# EAGLE design Pulsar Buddy rev A (EAGLE 9.5.2)

## Sheet 1 of 2
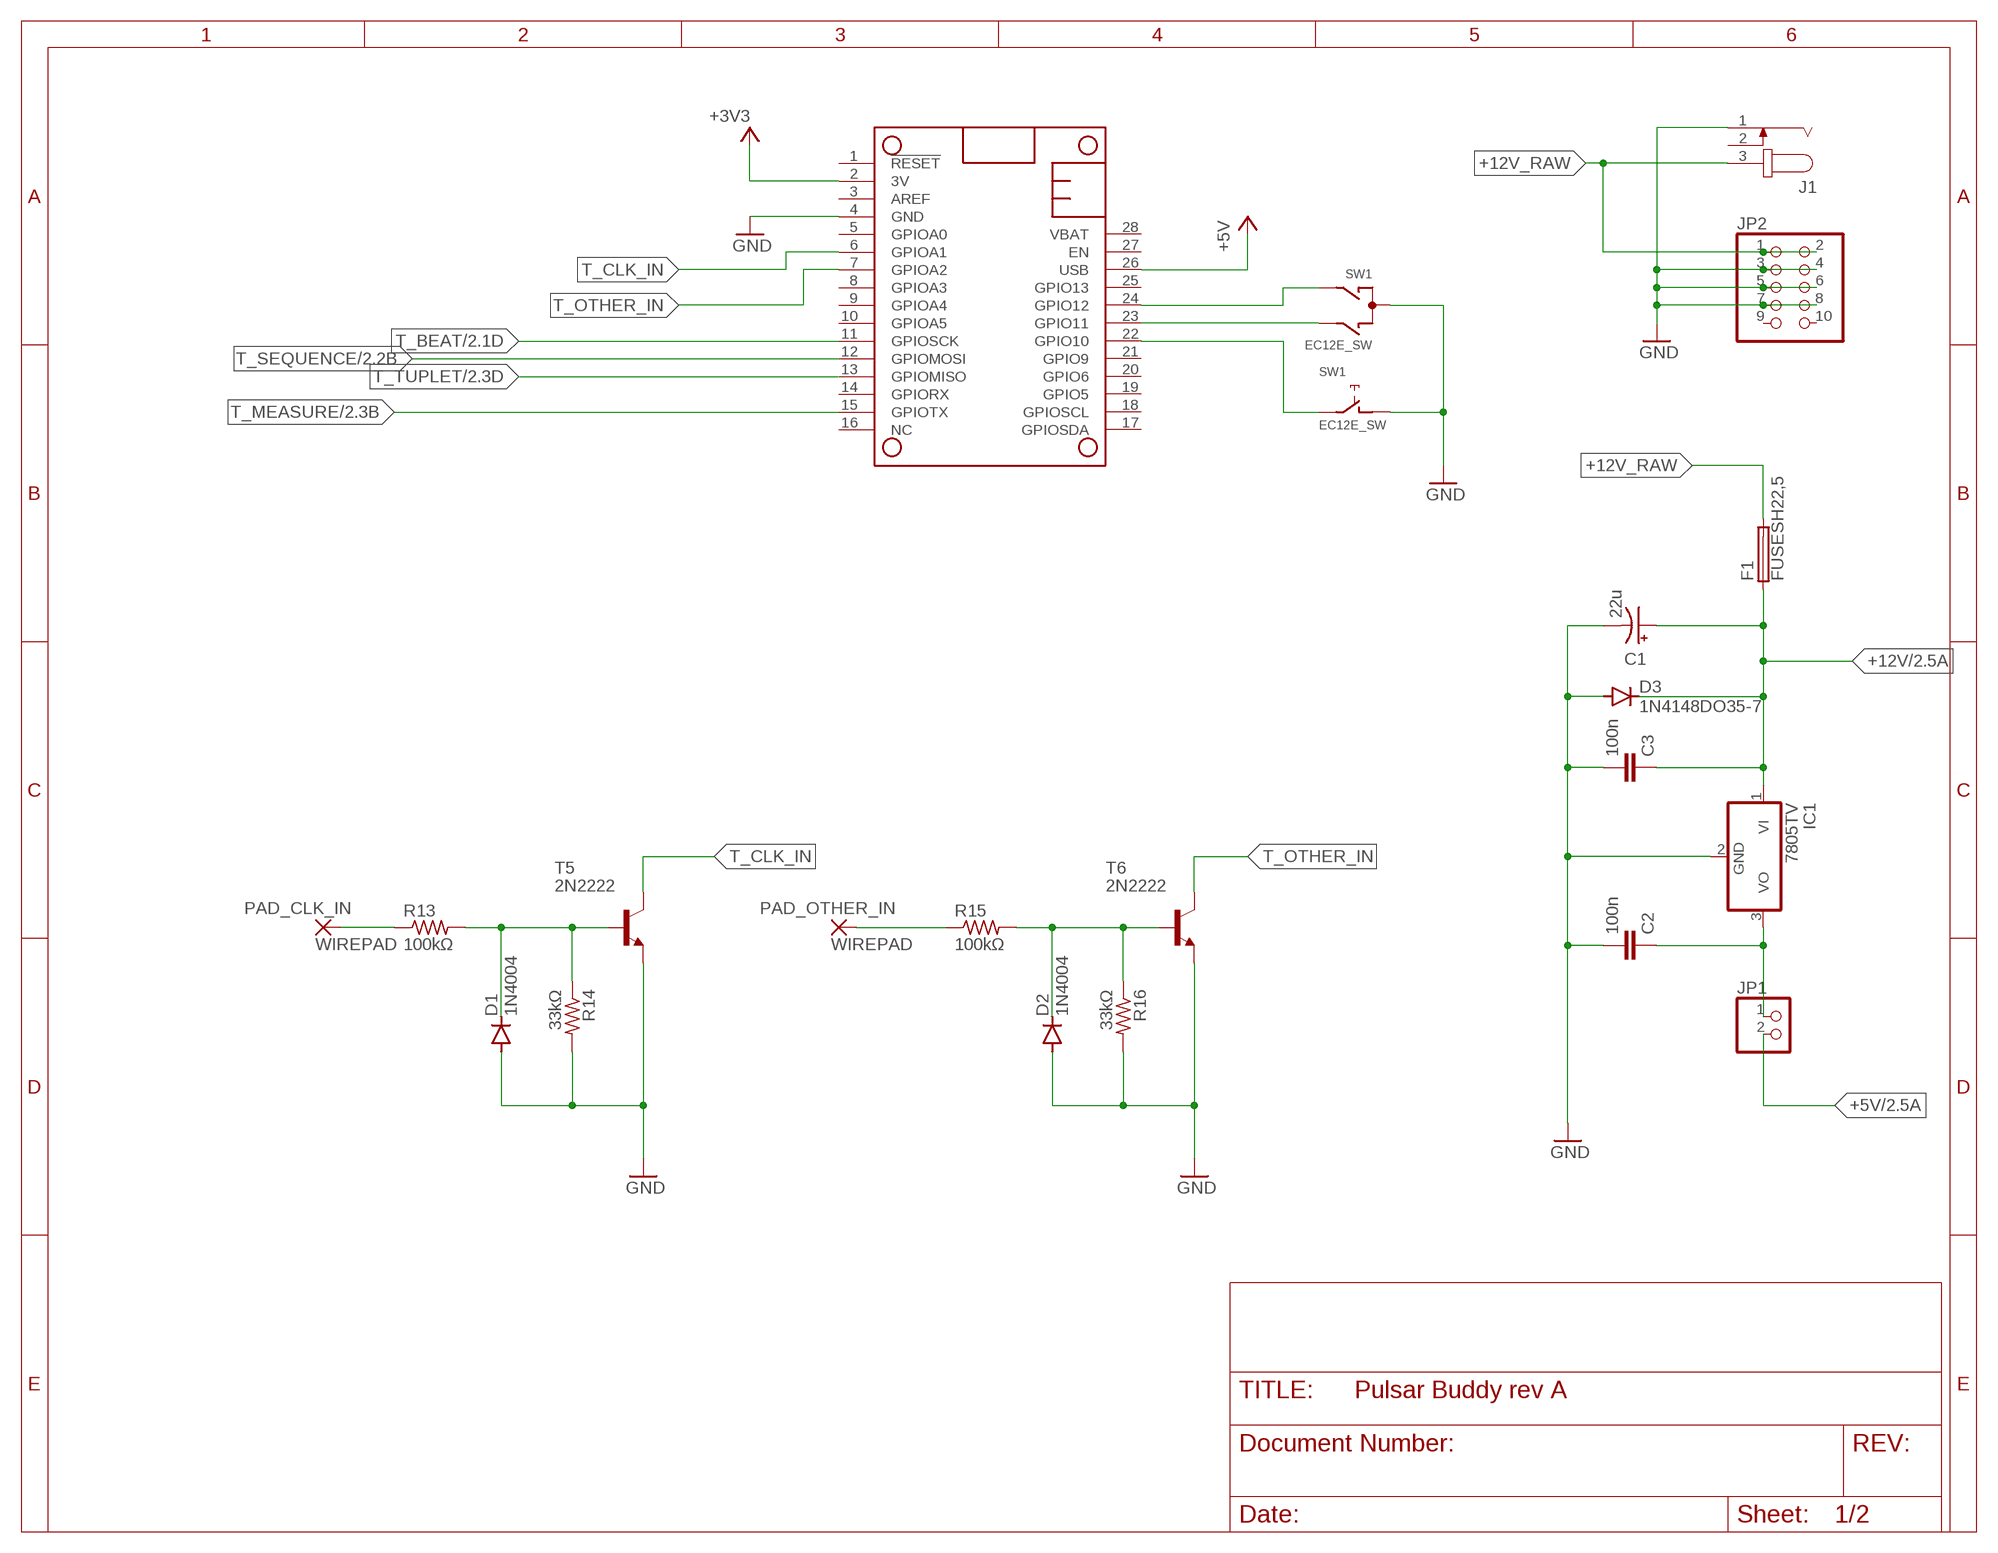
[diagram p0: schematic, sheet 1]

### Parts
C1  22u  CPOL-USE3.5-8  [E3,5-8]
C2  100n  C-EU025-024X044  [C025-024X044]
C3  100n  C-EU025-024X044  [C025-024X044]
D1  1N4004  [DO41-10]
D2  1N4004  [DO41-10]
D3  1N4148DO35-7  [DO35-7]
F1  FUSESH22,5  [SH22,5]
IC1  7805TV  [TO220V]
J1  JACK-PLUG0  [SPC4077]
JP1  PINHD-1X2  [1X02]
JP2  PINHD-2X5  [2X05]
MS2  FEATHERWING_NODIM  [FEATHERWING_DIM]
PAD_CLK_IN  WIREPAD  [M3]
PAD_OTHER_IN  WIREPAD  [M3]
R13  100kΩ  R-US_0204/7  [0204/7]
R14  33kΩ  R-US_0204/7  [0204/7]
R15  100kΩ  R-US_0204/7  [0204/7]
R16  33kΩ  R-US_0204/7  [0204/7]
SW1  EC12E_SW  [ALPS_EC12E_SW]
T5  2N2222  [TO92-EBC-OVAL]
T6  2N2222  [TO92-EBC-OVAL]

### Nets
+3V3: MS2.2(3V) ; also sheet 2
+5V: JP1.2 MS2.26(USB) ; also sheet 2
+12V: C1.+ C3.1 D3.C F1.1 IC1.1(VI) ; also sheet 2
+12V_RAW: F1.2 J1.3 JP2.1 JP2.2
GND: C1.- C2.2 C3.2 D1.A D2.A D3.A IC1.2(GND) J1.1 JP2.3 JP2.4 JP2.5 JP2.6 JP2.7 JP2.8 MS2.4(GND) R14.2 R16.2 SW1.C SW1.D T5.E T6.E ; also sheet 2
N$1: MS2.24(GPIO12) SW1.A
N$2: MS2.22(GPIO10) SW1.E
N$3: MS2.23(GPIO11) SW1.B
N$5: C2.1 IC1.3(VO) JP1.1
N$18: D1.C R13.2 R14.1 T5.B
N$19: PAD_OTHER_IN.1(P) R15.1
N$20: PAD_CLK_IN.1(P) R13.1
N$21: D2.C R15.2 R16.1 T6.B
T_BEAT: MS2.11(GPIOSCK) ; also sheet 2
T_CLK_IN: MS2.6(GPIOA1) T5.C
T_MEASURE: MS2.15(GPIOTX) ; also sheet 2
T_OTHER_IN: MS2.7(GPIOA2) T6.C
T_SEQUENCE: MS2.12(GPIOMOSI) ; also sheet 2
T_TUPLET: MS2.13(GPIOMISO) ; also sheet 2
Unconnected: J1.2 JP2.9 JP2.10 MS2.1(!RESET) MS2.3(AREF) MS2.5(GPIOA0) MS2.8(GPIOA3) MS2.9(GPIOA4) MS2.10(GPIOA5) MS2.14(GPIORX) MS2.16(NC) MS2.17(GPIOSDA) MS2.18(GPIOSCL) MS2.19(GPIO5) MS2.20(GPIO6) MS2.21(GPIO9) MS2.25(GPIO13) MS2.27(EN) MS2.28(VBAT) SW1.GND1(G) SW1.GND2(G)

## Sheet 2 of 2
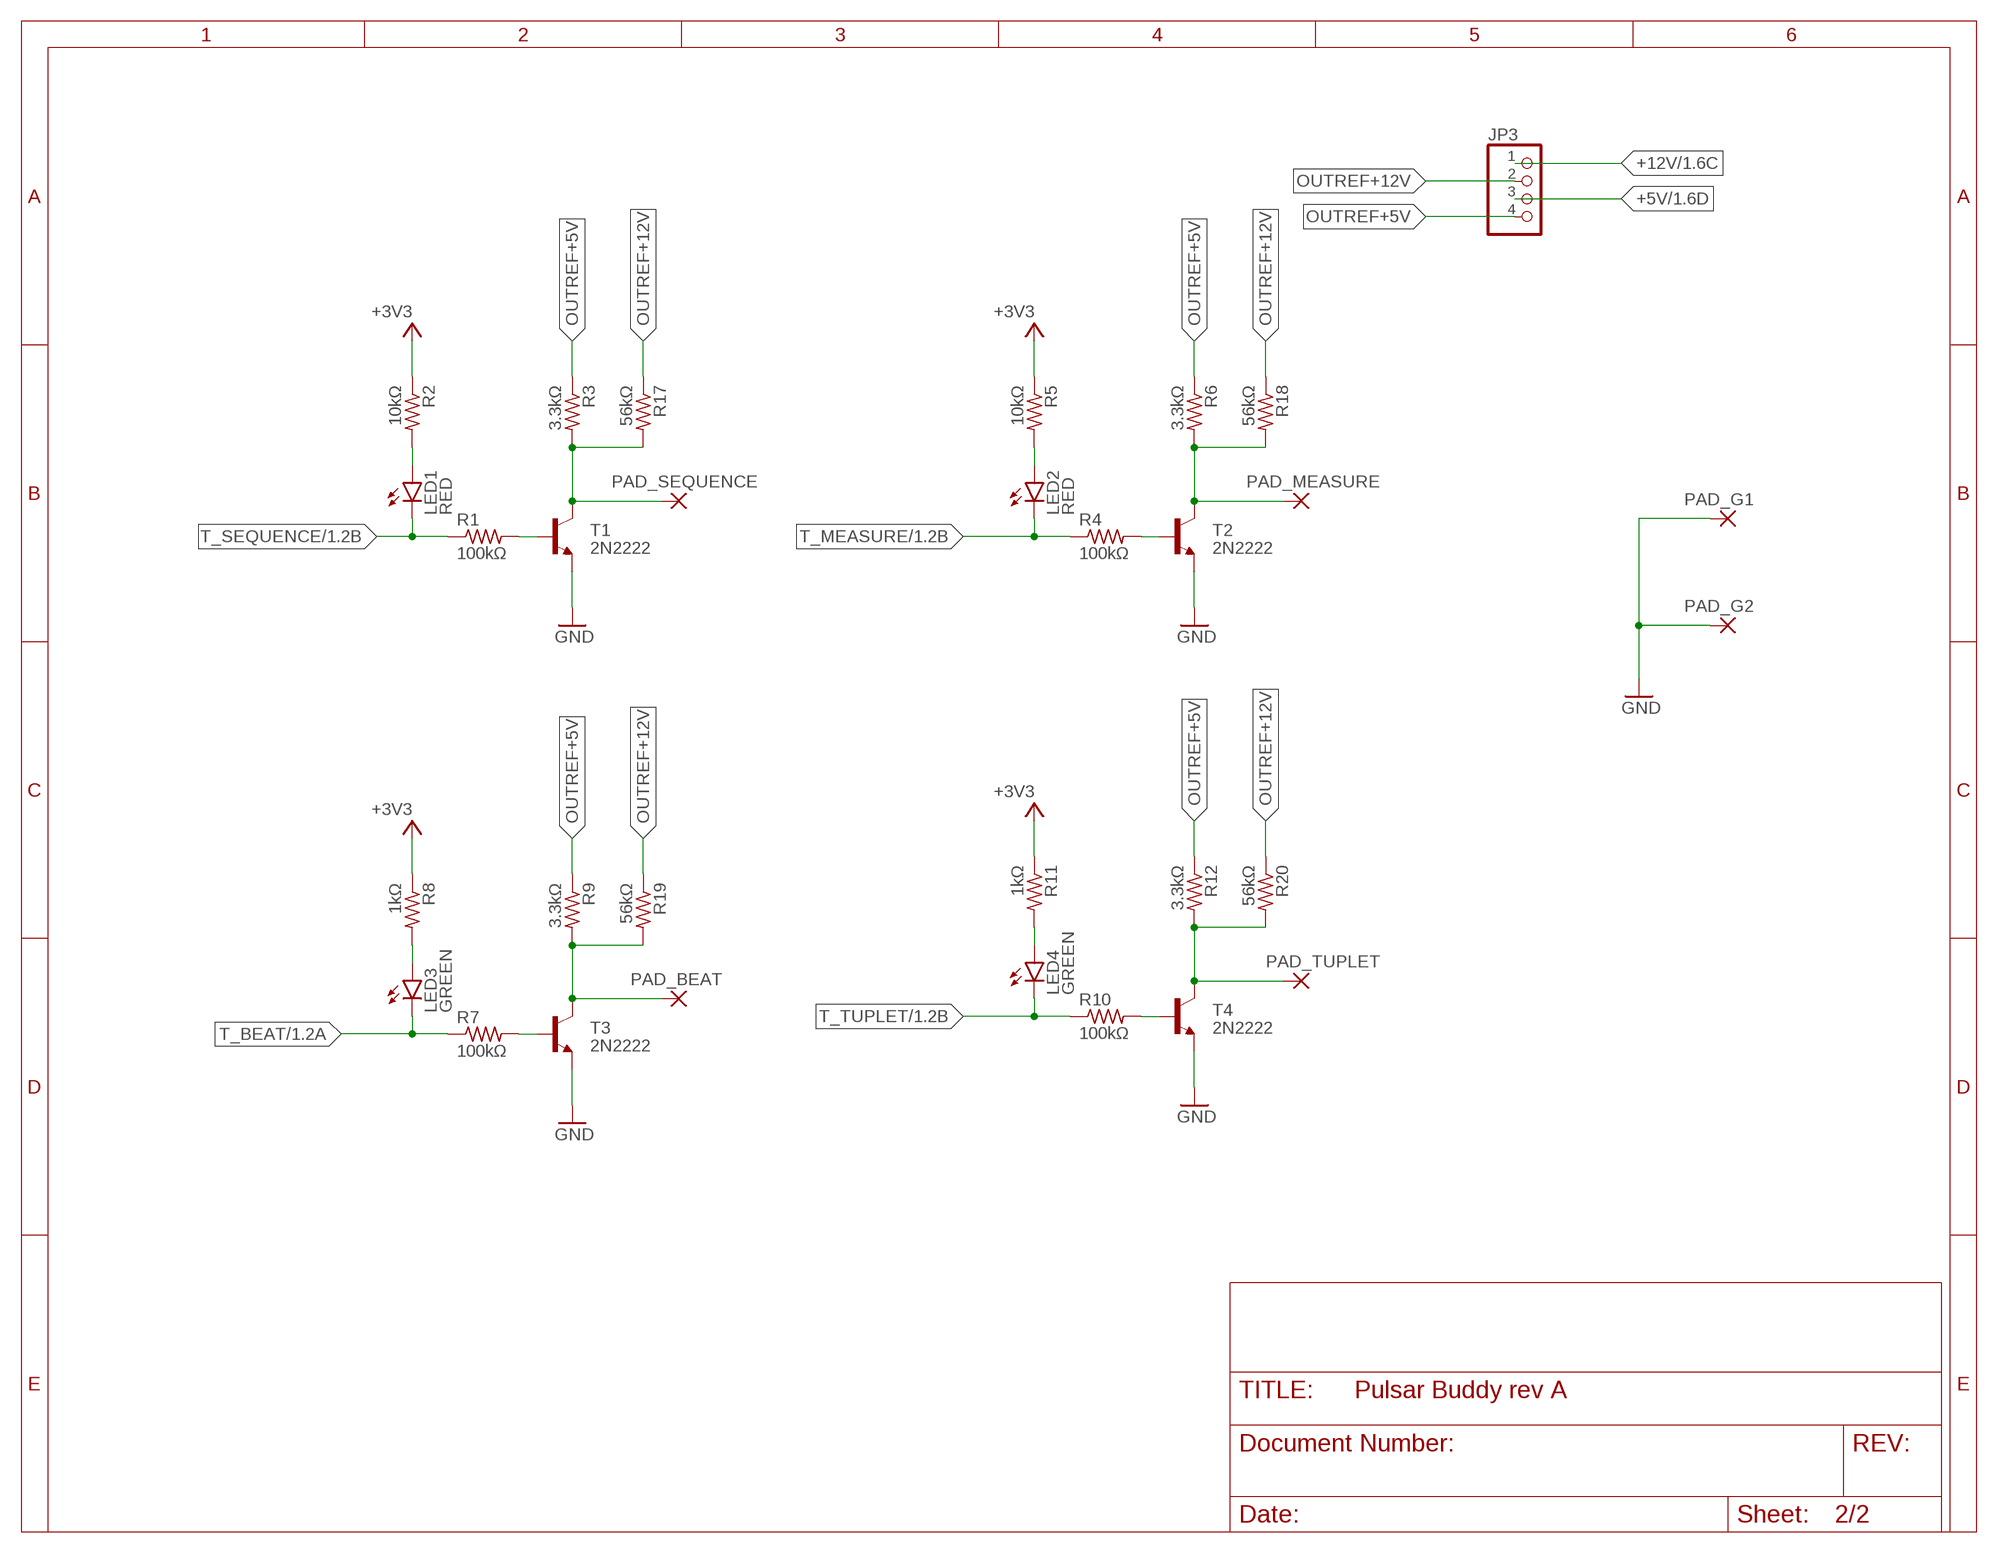
[diagram p1: schematic, sheet 2]

### Parts
JP3  PINHD-1X4  [1X04]
LED1  RED  LED5MM  [LED5MM]
LED2  RED  LED5MM  [LED5MM]
LED3  GREEN  LED5MM  [LED5MM]
LED4  GREEN  LED5MM  [LED5MM]
PAD_BEAT  WIREPAD  [M3]
PAD_G1  WIREPAD  [M3]
PAD_G2  WIREPAD  [M3]
PAD_MEASURE  WIREPAD  [M3]
PAD_SEQUENCE  WIREPAD  [M3]
PAD_TUPLET  WIREPAD  [M3]
R1  100kΩ  R-US_0204/7  [0204/7]
R2  10kΩ  R-US_0204/7  [0204/7]
R3  3.3kΩ  R-US_0204/7  [0204/7]
R4  100kΩ  R-US_0204/7  [0204/7]
R5  10kΩ  R-US_0204/7  [0204/7]
R6  3.3kΩ  R-US_0204/7  [0204/7]
R7  100kΩ  R-US_0204/7  [0204/7]
R8  1kΩ  R-US_0204/7  [0204/7]
R9  3.3kΩ  R-US_0204/7  [0204/7]
R10  100kΩ  R-US_0204/7  [0204/7]
R11  1kΩ  R-US_0204/7  [0204/7]
R12  3.3kΩ  R-US_0204/7  [0204/7]
R17  56kΩ  R-US_0204/7  [0204/7]
R18  56kΩ  R-US_0204/7  [0204/7]
R19  56kΩ  R-US_0204/7  [0204/7]
R20  56kΩ  R-US_0204/7  [0204/7]
T1  2N2222  [TO92-EBC-OVAL]
T2  2N2222  [TO92-EBC-OVAL]
T3  2N2222  [TO92-EBC-OVAL]
T4  2N2222  [TO92-EBC-OVAL]

### Nets
+3V3: R2.1 R5.1 R8.1 R11.1 ; also sheet 1
+5V: JP3.3 ; also sheet 1
+12V: JP3.1 ; also sheet 1
GND: PAD_G1.1(P) PAD_G2.1(P) T1.E T2.E T3.E T4.E ; also sheet 1
N$6: LED1.A R2.2
N$7: LED2.A R5.2
N$8: R1.2 T1.B
N$9: PAD_SEQUENCE.1(P) R3.2 R17.2 T1.C
N$10: R4.2 T2.B
N$11: PAD_MEASURE.1(P) R6.2 R18.2 T2.C
N$12: LED3.A R8.2
N$13: R7.2 T3.B
N$14: PAD_BEAT.1(P) R9.2 R19.2 T3.C
N$15: LED4.A R11.2
N$16: R10.2 T4.B
N$17: PAD_TUPLET.1(P) R12.2 R20.2 T4.C
OUTREF+5V: JP3.4 R3.1 R6.1 R9.1 R12.1
OUTREF+12V: JP3.2 R17.1 R18.1 R19.1 R20.1
T_BEAT: LED3.K(C) R7.1 ; also sheet 1
T_MEASURE: LED2.K(C) R4.1 ; also sheet 1
T_SEQUENCE: LED1.K(C) R1.1 ; also sheet 1
T_TUPLET: LED4.K(C) R10.1 ; also sheet 1

## Library data of the parts
C1 = rcl:CPOL-US: POLARIZED CAPACITOR, American symbol; SPICEPREFIX: C
C2 C3 = rcl:C-EU: CAPACITOR, European symbol; SPICEPREFIX: C
D1 D2 = diode:1N4004: DIODE general purpose rectifier, 1 A
D3 = diode:1N4148: DIODE high speed (Philips)
F1 = fuse:FUSE: Fuse; OC_FARNELL: unknown; OC_NEWARK: unknown
IC1 = linear:78*: Positive VOLTAGE REGULATOR Source: http://cache.national.com/ds/LM/LM78L05.pdf http://www.fairchildsemi.com/ds/LM/LM7805.pdf
J1 = con-jack:JACK-PLUG: DC POWER JACK Power Jack, DC, Right Angle, Through Hole, Rated 5A at 16VDC, PC Terminals Distributor: Farnell (www.Farnell.de) Drawing: 84N1161.pdf / 84N1162.pdf Manufacturer: SPC Technology (www.spctechnology.com) Type: SPC4077 / SPC 4078; OC_FARNELL: unknown; OC_NEWARK: unknown
JP1 = pinhead:PINHD-1X2: PIN HEADER
JP2 = pinhead:PINHD-2X5: PIN HEADER
JP3 = pinhead:PINHD-1X4: PIN HEADER
LED1-LED4 = led:LED: LED OSRAM: - CHIPLED LG R971, LG N971, LY N971, LG Q971, LY Q971, LO R971, LY R971 LH N974, LH R974 LS Q976, LO Q976, LY Q976 LO Q996 - Hyper CHIPLED LW Q18S LB Q993, LB Q99A, LB R99A - SideLED LS A670, LO A670, LY A670, LG A670, LP A670 LB A673, LV A673, LT A673, LW A673 LH A674 LY A675 LS A676, LA A676, LO A676, LY A676, LW A676 LS A679, LY A679, LG A679 - Hyper Micro SIDELED® LS Y876, LA Y876, LO Y876, LY Y876 LT Y87S - SmartLED LW L88C, LW L88S LB L89C, LB L89S, LG L890 LS L89K, LO L89K, LY L89K LS L896, LA L896, LO L896, LY L896 - TOPLED LS T670, LO T670, LY T670, LG T670, LP T670 LSG T670, LSP T670, LSY T670, LOP T670, LYG T670 LG T671, LOG T671, LSG T671 LB T673, LV T673, LT T673, LW T673 LH T674 LS T676, LA T676, LO T676, LY T676, LB T676, LH T676, LSB T676, LW T676 LB T67C, LV T67C, LT T67C, LS T67K, LO T67K, LY T67K, LW E67C LS E67B, LA E67B, LO E67B, LY E67B, LB E67C, LV E67C, LT E67C LW T67C LS T679, LY T679, LG T679 LS T770, LO T770, LY T770, LG T770, LP T770 LB T773, LV T773, LT T773, LW T773 LH T774 LS E675, LA E675, LY E675, LS T675 LS T776, LA T776, LO T776, LY T776, LB T776 LHGB T686 LT T68C, LB T68C - Hyper Mini TOPLED® LB M676 - Mini TOPLED Santana® LG M470 LS M47K, LO M47K, LY M47K Source: http://www.osram.convergy.de LUXEON: - LUMILED® LXK2-PW12-R00, LXK2-PW12-S00, LXK2-PW14-U00, LXK2-PW14-V00 LXK2-PM12-R00, LXK2-PM12-S00, LXK2-PM14-U00 LXK2-PE12-Q00, LXK2-PE12-R00, LXK2-PE12-S00, LXK2-PE14-T00, LXK2-PE14-U00 LXK2-PB12-K00, LXK2-PB12-L00, LXK2-PB12-M00, LXK2-PB14-N00, LXK2-PB14-P00, LXK2-PB14-Q00 LXK2-PR12-L00, LXK2-PR12-M00, LXK2-PR14-Q00, LXK2-PR14-R00 LXK2-PD12-Q00, LXK2-PD12-R00, LXK2-PD12-S00 LXK2-PH12-R00, LXK2-PH12-S00 LXK2-PL12-P00, LXK2-PL12-Q00, LXK2-PL12-R00 Source: www.luxeon.com KINGBRIGHT: KA-3528ASYC Source: www.kingbright.com
MS2 = adafruit:FEATHERWING
PAD_BEAT PAD_CLK_IN PAD_G1 PAD_G2 PAD_MEASURE PAD_OTHER_IN PAD_SEQUENCE PAD_TUPLET = bits:WIREPAD: Wire PAD connect wire on PCB
R1-R20 = rcl:R-US_: RESISTOR, American symbol; SPICEPREFIX: R
SW1 = switch-alps:EC12E_SW: ALPS rotary Encoder EC12E series with switch; MPN: EC12E2424407; OC_FARNELL: 1520813; OC_NEWARK: 74M1068
T1-T6 = adafruit:2N2222: NPN TRANSISTOR Big oval pads

## Board
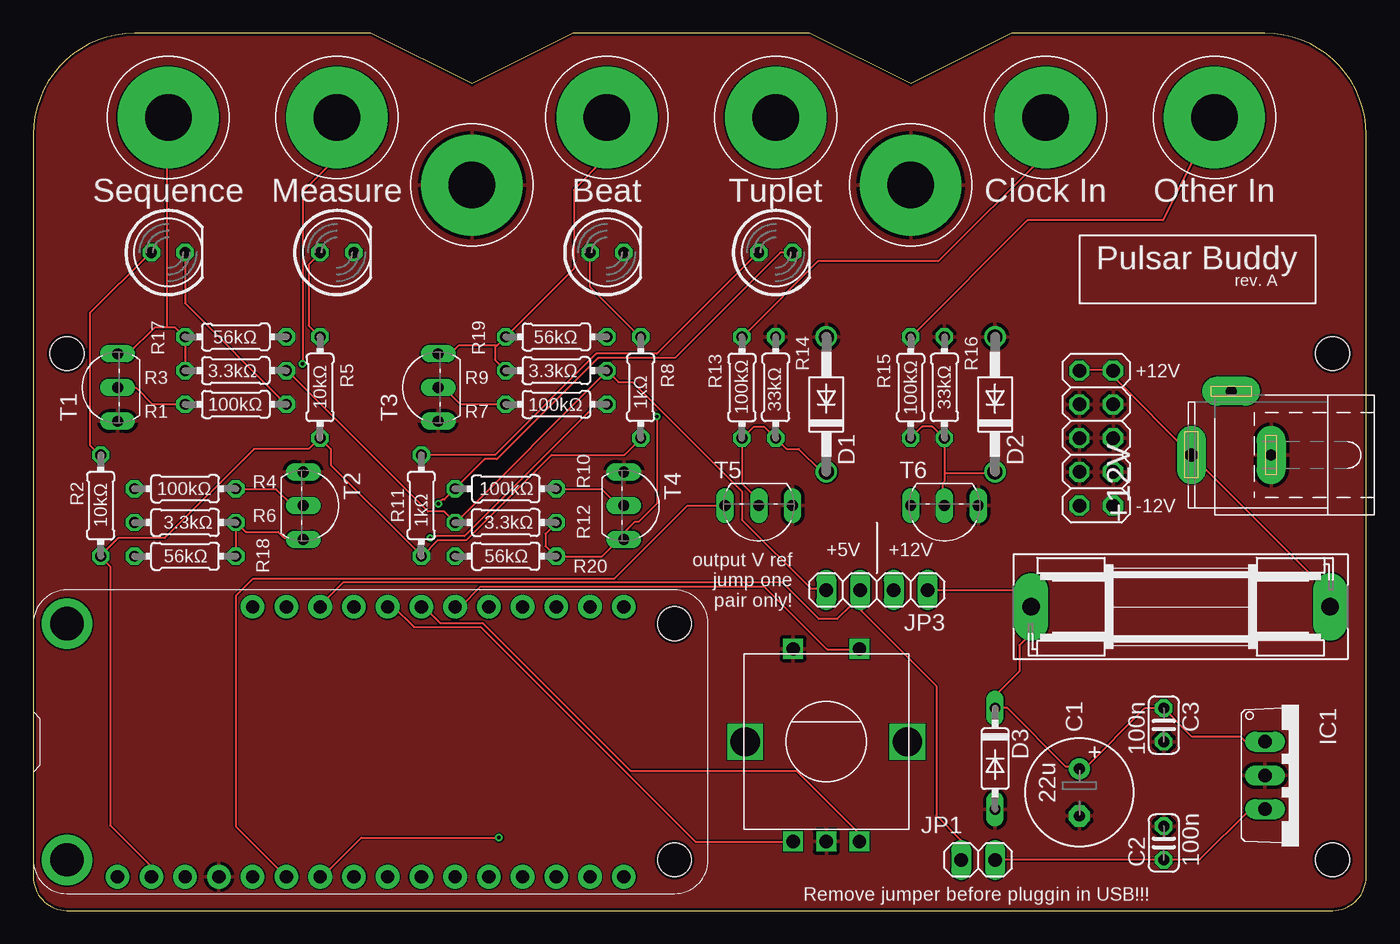
[diagram p2: board, top side]
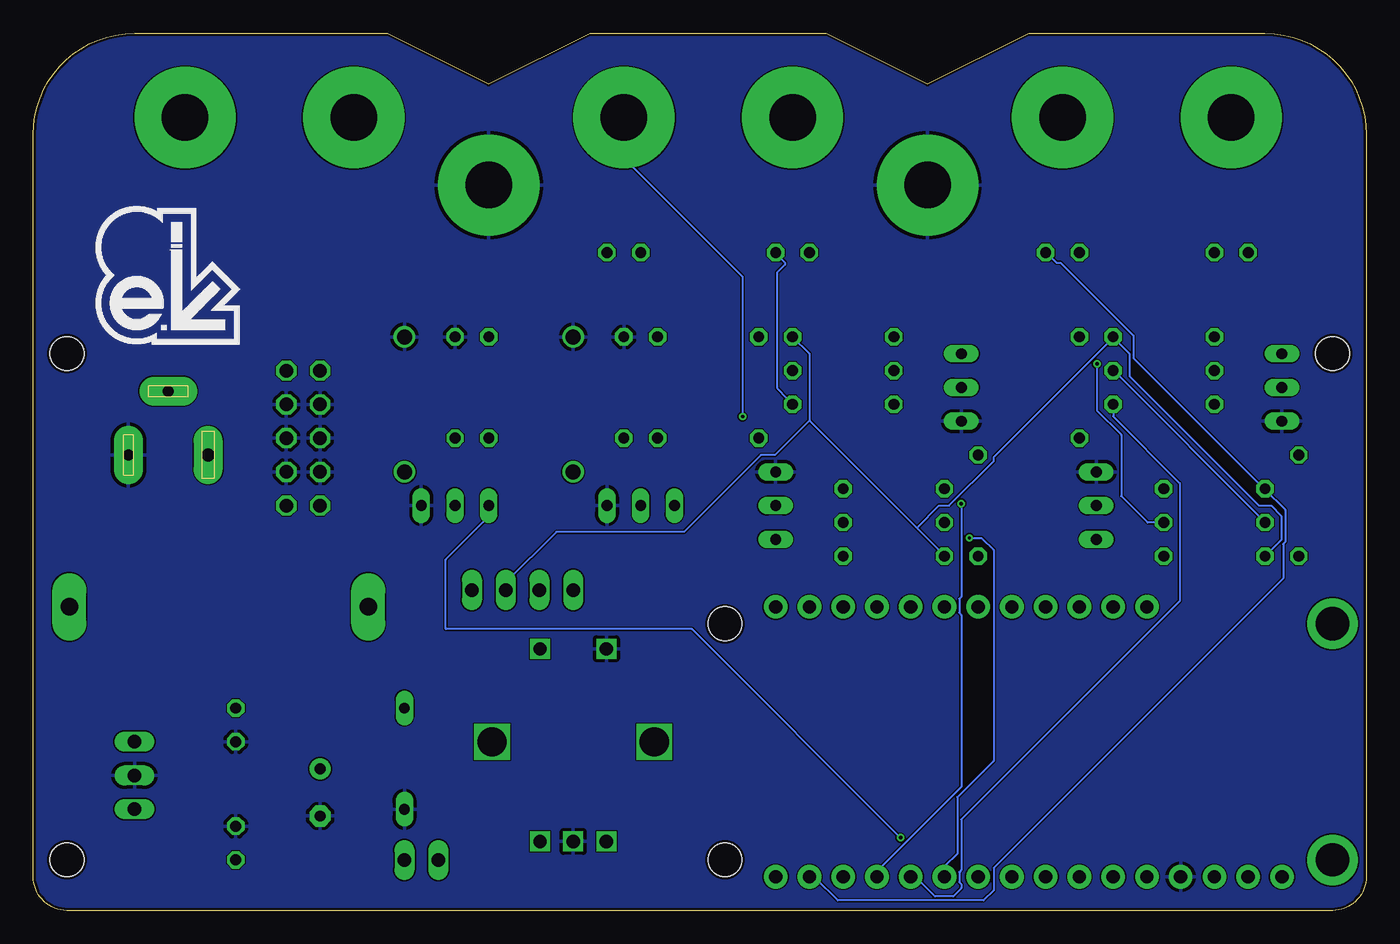
[diagram p3: board, bottom side, seen from below]

Size 100.33 x 66.04 mm. Coordinates in mm from the lower left corner, seen from the top.
Outline: 2.54,0 97.79,0 arc90 100.33,2.54 100.33,58.41 arc90 92.71,66.03 73.66,66.04 66.04,62.23 58.42,66.04 40.64,66.04 33.02,62.23 25.4,66.04 7.62,66.03 arc90 0,58.41 0,2.54 arc90 2.54,0
Copper layers (1*16): Top 0.035mm / dielectric 1.5mm / Bottom 0.035mm
Design rules "aisler_2_layer": minimum track width 0.1mm, minimum drill 0.2mm, track to track 0.1mm, track to pad 0.1mm, pad to pad 0.1mm, via to via 0.1mm, smd to smd 0.1mm, copper to edge 0.2mm, drill to drill 0.21mm, minimum pad ring 0.25mm, minimum via ring 0.15mm, stop-mask expansion 0mil, vias tented up to drill 0mil, thermal gap 10mil
Holes 2.54 mm at 2.54,41.91 97.79,41.91 97.79,3.81

### Footprints (pad centres in the part's own frame; a part is rotated, then mirrored left to right if it is on the bottom)
E3,5-8 = drill 0.813 pad 1.6: + -1.778,0 | drill 0.813 pad 1.6 octagon: - 1.778,0
C025-024X044 = drill 0.813 octagon: 1 -1.27,0; 2 1.27,0
DO41-10 = drill 1.118: A 5.08,0; C -5.08,0
DO35-7 = drill 0.813 long: A 3.81,0; C -3.81,0
SH22,5 = drill 1.321 pad 2.54 long: 1 -11.252,0; 2 11.252,0
TO220V = drill 1.016 long: 1 -2.54,-2.54; 2 0,-2.54; 3 2.54,-2.54
SPC4077 = drill 0.8 pad 2.184 long: 1 -3,0; 2 0,-4.8 | drill 1 pad 2.184 long: 3 3,0
1X02 = drill 1.016 long: 1 -1.27,0; 2 1.27,0
2X05 = drill 1.016 octagon: 1 -5.08,-1.27; 2 -5.08,1.27; 3 -2.54,-1.27; 4 -2.54,1.27; 5 0,-1.27; 6 0,1.27; 7 2.54,-1.27; 8 2.54,1.27; 9 5.08,-1.27; 10 5.08,1.27
1X04 = drill 1.016 long: 1 -3.81,0; 2 -1.27,0; 3 1.27,0; 4 3.81,0
LED5MM = drill 0.813 octagon: A -1.27,0; K 1.27,0
FEATHERWING_DIM = drill 1 pad 1.778: 1 6.35,1.27; 2 8.89,1.27; 3 11.43,1.27; 4 13.97,1.27; 5 16.51,1.27; 6 19.05,1.27; 7 21.59,1.27; 8 24.13,1.27; 9 26.67,1.27; 10 29.21,1.27; 11 31.75,1.27; 12 34.29,1.27; 13 36.83,1.27; 14 39.37,1.27; 15 41.91,1.27; 16 44.45,1.27; 17 44.45,21.59; 18 41.91,21.59; 19 39.37,21.59; 20 36.83,21.59; 21 34.29,21.59; 22 31.75,21.59; 23 29.21,21.59; 24 26.67,21.59; 25 24.13,21.59; 26 21.59,21.59; 27 19.05,21.59; 28 16.51,21.59 | drill 2.5 pad 3.81: P$1 2.54,20.32; P$2 2.54,2.54 | hole 2.54: 48.26,20.32; 48.26,2.54
M3 = drill 3.5 pad 7.62: 1 0,0
0204/7 = drill 0.813 octagon: 1 -3.81,0; 2 3.81,0
ALPS_EC12E_SW = drill 1 square: A -2.5,-7.5; B 2.5,-7.5; C 0,-7.5; D -2.5,7; E 2.5,7 | drill 2.2 square: GND1 -6.1,0; GND2 6.1,0
TO92-EBC-OVAL = drill 0.813 long: B 0,-1.27; C 2.54,-1.27; E -2.54,-1.27

### Placement (x,y rotation side)
C1  78.74,8.89 270 top
C2  85.09,5.08 90 top
C3  85.09,13.97 270 top
D1  59.69,38.1 90 top
D2  72.39,38.1 90 top
D3  72.39,11.43 270 top
F1  86.36,22.86 0 top
IC1  95.25,10.16 270 top
J1  90.17,34.29 180 top
JP1  71.12,3.81 180 top
JP2  80.01,35.56 270 top
JP3  63.5,24.13 180 top
LED1  10.16,49.53 0 top
LED2  22.86,49.53 0 top
LED3  43.18,49.53 0 top
LED4  55.88,49.53 0 top
MS2  0,1.27 0 top
PAD_BEAT  43.18,59.69 0 top
PAD_CLK_IN  76.2,59.69 0 top
PAD_G1  33.02,54.61 0 top
PAD_G2  66.04,54.61 0 top
PAD_MEASURE  22.86,59.69 0 top
PAD_OTHER_IN  88.9,59.69 0 top
PAD_SEQUENCE  10.16,59.69 0 top
PAD_TUPLET  55.88,59.69 0 top
R1  15.24,38.1 180 top
R2  5.08,30.48 90 top
R3  15.24,40.64 180 top
R4  11.43,31.75 0 top
R5  21.59,39.37 90 top
R6  11.43,29.21 0 top
R7  39.37,38.1 180 top
R8  45.72,39.37 90 top
R9  39.37,40.64 180 top
R10  35.56,31.75 0 top
R11  29.21,30.48 90 top
R12  35.56,29.21 0 top
R13  53.34,39.37 270 top
R14  55.88,39.37 90 top
R15  66.04,39.37 270 top
R16  68.58,39.37 90 top
R17  15.24,43.18 180 top
R18  11.43,26.67 0 top
R19  39.37,43.18 180 top
R20  35.56,26.67 0 top
SW1  59.69,12.7 0 top
T1  5.08,39.37 90 top
T2  21.59,30.48 270 top
T3  29.21,39.37 90 top
T4  45.72,30.48 270 top
T5  54.61,29.21 180 top
T6  68.58,29.21 180 top

### Tracks (layer width: path | path; a pad name or v marks a point on that pad's centre or on a via)
+3V3
  Top 0.152: R8.1 45.72,35.51 44.5,34.29 39.01,34.29 32.61,27.89 30.48,27.89 29.26,26.67 R11.1 29.11,26.67 28.8,26.98 28.8,27.13 22.4,33.53 22.4,34.75 R5.1 21.49,35.51 20.73,34.75 16.61,34.75 9.91,28.04 6.4,28.04 5.49,27.13 5.49,26.98 5.18,26.67 R2.1 5.03,26.67 5.79,25.91 5.79,6.4 8.84,3.35 8.84,2.59 MS2.2
+5V
  Top 0.152: 62.33,23.01 62.33,24.08 JP3.3 62.33,23.01 | 62.33,23.01 62.33,22.55 67.97,16.92 67.97,7.16 69.8,5.33 69.8,3.81 JP1.2 | 62.33,23.01 61.57,23.01 60.5,21.95 59.13,21.95 56.39,24.69 23.32,24.69 22.1,23.47 22.1,23.32 21.64,22.86 MS2.26
+12V
  Top 0.152: 74.98,22.86 74.98,20.73 74.22,19.96 74.22,17.98 72.39,16.15 D3.C 73.3,15.24 77.72,10.82 78.49,10.82 78.64,10.67 C1.+ 79.1,10.67 83.67,15.24 85.04,15.24 | 74.98,22.86 73.76,24.08 67.36,24.08 JP3.1 | 74.98,22.86 F1.1 | 85.04,15.24 87.17,13.11 90.83,13.11 91.14,12.8 92.66,12.8 IC1.1 | 85.04,15.24 C3.1
+12V_RAW
  Top 0.152: JP2.1 78.79,40.69 81.23,40.69 JP2.2 81.28,40.18 J1.3 97.54,23.92 97.54,22.86 F1.2
GND
  pour Top: -1.27,67.31 -1.27,-1.27 101.6,-1.27 101.6,67.31
  pour Bottom: -1.27,67.31 -1.27,-1.27 101.6,-1.27 101.6,67.31
N$1
  Top 0.152: MS2.24 27.13,22.86 28.65,21.34 33.68,21.34 49.84,5.18 57.15,5.18 SW1.A
N$2
  Top 0.152: MS2.22 32.16,22.86 33.68,24.38 55.02,24.38 59.74,19.66 62.18,19.66 SW1.E
N$3
  Top 0.152: MS2.23 29.41,22.86 30.63,21.64 33.83,21.64 44.96,10.52 57.45,10.52 62.18,5.79 62.18,5.33 SW1.B
N$5
  Top 0.152: IC1.3 91.59,7.62 87.78,3.81 C2.1 JP1.1
N$6
  Top 0.152: R2.2 5.03,34.29 4.27,35.05 4.27,44.96 8.84,49.53 LED1.A
N$7
  Top 0.152: R5.2 20.73,44.04 20.73,48.62 21.64,49.53 LED2.A
N$8
  Top 0.152: R1.2 8.99,38.1 7.77,39.32 6.4,39.32 T1.B
N$9
  Top 0.152: T1.C 7.16,41.91 9.14,43.89 10.06,43.89 | 10.06,43.89 10.67,43.89 11.43,43.13 | 11.43,43.13 R3.2 | 11.43,43.13 R17.2 | 10.06,43.89 10.06,59.59 PAD_SEQUENCE.1
N$10
  Top 0.152: T2.B 19.51,30.48 18.29,31.7 15.24,31.7 R4.2
N$11  (via drill 0.25)
  Top 0.152: R6.2 15.24,28.8 | 15.24,28.8 R18.2 | 15.24,28.8 15.7,28.8 16,28.5 18.44,28.5 18.9,28.04 20.27,28.04 T2.C | v20.27,41.15 20.27,54.1 22.86,56.69 PAD_MEASURE.1
  Bottom 0.152: R6.2 16.46,29.21 18.44,31.19 18.44,35.81 20.27,37.64 v20.27,41.15
N$12
  Top 0.152: LED3.A 41.91,46.94 45.72,43.13 R8.2
N$13
  Top 0.152: R7.2 32.16,38.1 30.94,39.32 30.48,39.32 T3.B
N$14
  Top 0.152: T3.C 31.39,41.91 32,42.52 34.75,42.52 | 34.75,42.52 34.9,42.52 R19.2 40.69,48.31 40.69,54.25 43.13,56.69 43.13,59.59 PAD_BEAT.1 | R9.2 34.75,41.45 34.75,42.52
N$15
  Top 0.152: R11.2 34.75,34.29 42.37,41.91 46.94,41.91 54.56,49.53 LED4.A
N$16
  Top 0.152: T4.B 44.04,30.48 42.82,31.7 39.47,31.7 R10.2
N$17  (via drill 0.25)
  Top 0.152: R12.2 39.32,29.11 38.56,28.35 38.56,27.43 39.32,26.67 R20.2 42.82,26.67 44.04,27.89 44.35,27.89 T4.C 44.5,28.04 44.5,28.5 45.26,29.26 45.57,29.26 46.94,30.63 v46.94,37.19
  Bottom 0.152: v46.94,37.19 46.94,47.7 55.78,56.54 55.78,59.59 PAD_TUPLET.1
N$18
  Top 0.152: 53.34,35.51 53.34,32.16 54.56,30.94 54.56,30.48 T5.B | 53.34,35.51 54.25,36.42 55.02,36.42 R14.1 56.69,34.75 57.61,34.75 59.28,33.07 59.59,33.07 D1.C | 53.34,35.51 R13.2
N$19
  Top 0.152: R15.1 74.83,51.97 85.04,51.97 PAD_OTHER_IN.1
N$20
  Top 0.152: PAD_CLK_IN.1 76.2,56.95 68.12,48.87 59.08,48.87 53.8,43.59 53.65,43.59 53.34,43.28 R13.1
N$21
  Top 0.152: T6.B 68.58,31.55 68.43,31.7 68.43,32.16 68.58,32.31 68.58,32.92 | 68.58,35.51 68.58,32.92 | R15.2 66.9,36.42 67.67,36.42 68.58,35.51 | 68.58,35.51 R16.1 | 68.58,32.92 72.39,32.92 D2.C
OUTREF+5V
  Top 0.152: JP3.4 59.59,24.23 58.52,24.23 53.34,29.41 53.34,31.55 45.11,39.78 44.04,39.78 R9.1 43.13,40.54 31.85,29.26 R12.1 30.94,30.02 29.72,30.02 19.51,40.23 19.36,40.23 19.05,40.54 R3.1
  Bottom 0.152: R6.1 7.62,29.26 19.05,40.69 R3.1
OUTREF+12V
  Bottom 0.152: R18.1 6.4,27.89 6.4,29.72 7.16,30.48 8.08,30.48 17.83,40.23 17.83,41.91 19.05,43.13 | 41.91,36.88 33.83,28.8 | 33.83,28.8 32.16,27.13 32.16,26.98 31.85,26.67 R20.1 | 41.91,36.88 41.91,41.91 R19.1 | JP3.2 64.77,24.69 60.96,28.5 51.36,28.5 45.57,34.29 44.5,34.29 41.91,36.88 | 19.05,43.13 28.04,34.14 28.04,33.83 31.39,30.48 32.16,30.48 33.83,28.8 | 19.05,43.13 R17.1
T_BEAT  (via drill 0.25)
  Top 0.152: v29.87,28.04 30.18,28.04 30.33,28.19 32.46,28.19 41.91,37.64 41.91,37.8 42.22,38.1 R7.1
  Bottom 0.152: R7.1 43.28,38.1 43.59,38.41 43.59,38.56 44.35,39.32 44.35,48.01 43.74,48.62 43.74,48.77 44.5,49.53 LED3.K | v29.87,28.04 28.96,28.04 28.04,27.13 28.04,11.28 30.79,8.53 30.79,4.27 31.7,3.35 31.7,2.59 MS2.11
T_CLK_IN
  Top 0.152: T5.C 49.23,30.48 43.74,24.99 16.56,24.99 15.24,23.67 15.24,6.35 MS2.6
T_MEASURE
  Bottom 0.152: LED2.K 24.08,49.53 23.32,48.77 23.01,48.77 17.53,43.28 17.53,41.6 8.08,32.16 7.92,32.16 7.62,31.85 R4.1 7.62,31.7 6.1,30.18 6.1,27.74 6.25,27.58 6.25,24.99 28.04,3.2 28.04,1.52 28.8,0.76 39.78,0.76 41.45,2.44 41.91,2.44 MS2.15
T_OTHER_IN  (via drill 0.25)
  Top 0.152: v35.05,5.49 24.69,5.49 21.64,2.44 MS2.7
  Bottom 0.152: T6.C 66.04,29.67 69.29,26.42 69.29,21.18 50.75,21.18 v35.05,5.49
T_SEQUENCE
  Top 0.152: R1.1 11.43,45.72 LED1.K
  Bottom 0.152: R1.1 19.05,37.19 14.02,32.16 14.02,23.32 30.48,6.86 30.48,3.05 30.63,2.9 30.63,2.13 30.48,1.98 30.48,1.68 31.09,1.07 32.46,1.07 33.83,2.44 34.29,2.44 MS2.12
T_TUPLET  (via drill 0.25)
  Top 0.152: LED4.K 56.24,49.53 48.31,41.6 42.52,41.6 34.9,33.98 33.98,33.98 R10.1 30.94,30.94 30.79,30.94 v30.48,30.63
  Bottom 0.152: v30.48,30.63 30.48,23.62 30.63,23.47 30.63,22.4 30.48,22.25 30.48,9.3 36.73,3.05 36.73,2.59 MS2.13

### Text on the board
tNames: ⏚ | ⏚ | Sequence | Measure | Beat | Tuplet | Clock In | Other In | Pulsar Buddy | rev. A | +12V | -12V | +12V | +5V | +12V | output V ref / jump one / pair only! | Remove jumper before pluggin in USB!!!